# Altium schematic sheet Block_Diagram_01.SchDoc
size A4; SheetNumber: 2; SheetTotal: 13
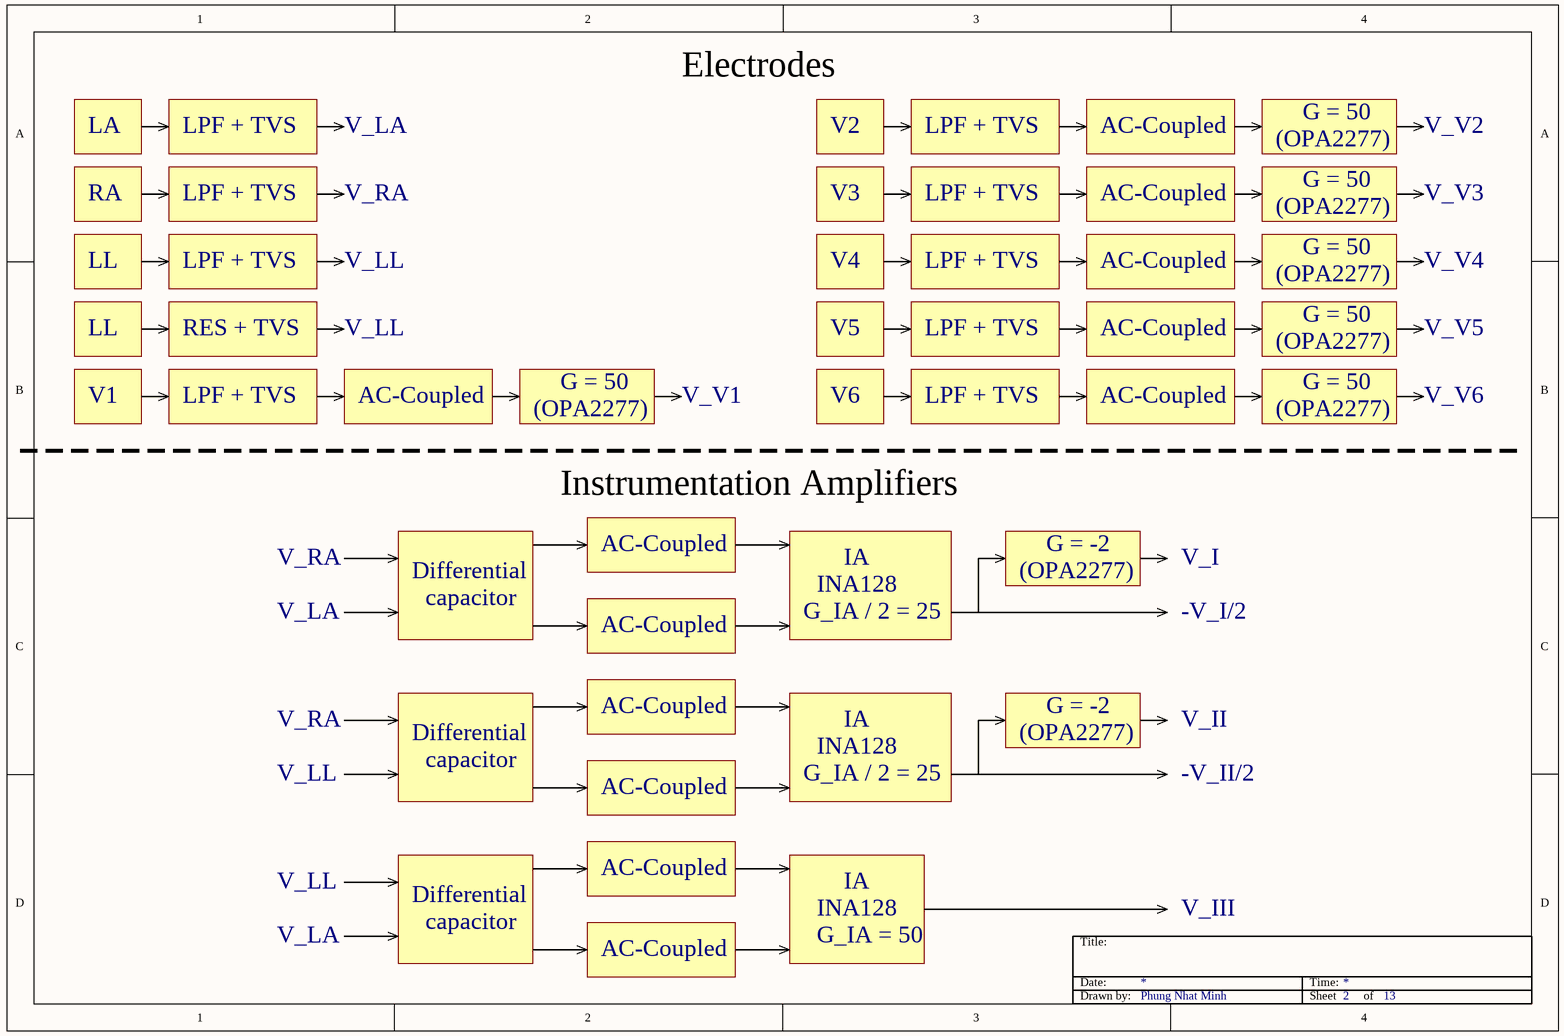
[diagram p0: Block_Diagram_01.SchDoc]

## Notes on the sheet
- Electrodes
- LA
- LPF + TVS
- V_LA
- V2
- AC-Coupled
- (OPA2277)
- G = 50
- V_V2
- RA
- V_RA
- V3
- V_V3
- LL
- V_LL
- V4
- V_V4
- RES + TVS
- V5
- V_V5
- V1
- V_V1
- V6
- V_V6
- Instrumentation Amplifiers
- Differential
- IA
- G = -2
- V_I
- capacitor
- G_IA / 2 = 25
- INA128
- -V_I/2
- V_II
- -V_II/2
- V_III
- G_IA = 50
- Title:
- Date:
- Time:
- Drawn by:
- Phung Nhat Minh
- Sheet
- of